# EAGLE design DRV8833 (EAGLE 7.2.0)
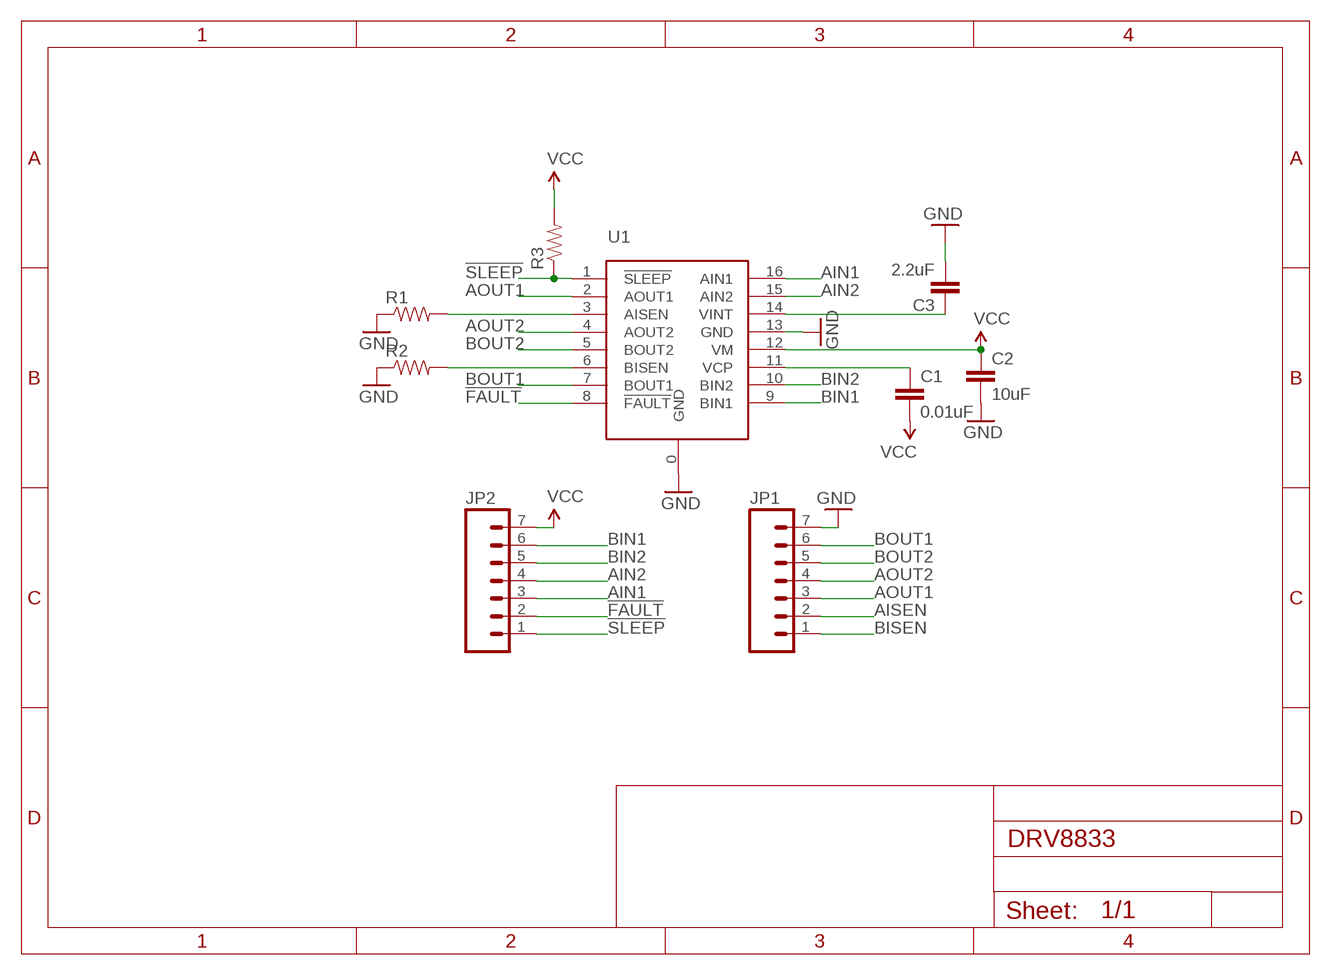
[diagram p0: schematic, sheet 1]

## Parts
C1  0.01uF  CAP0603-CAP  [0603-CAP]
C2  10uF  CAP1206  [1206]
C3  2.2uF  CAP0603-CAP  [0603-CAP]
JP1  M07  [1X07]
JP2  M07  [1X07]
R1  RESISTOR1206  [1206]
R2  RESISTOR1206  [1206]
R3  RESISTOR0603-RES  [0603-RES]
U1  DRV8833  [PWP16]

## Nets
!FAULT: JP2.2 U1.8(!FAULT)
!SLEEP: JP2.1 R3.1 U1.1(!SLEEP)
AIN1: JP2.3 U1.16(AIN1)
AIN2: JP2.4 U1.15(AIN2)
AISEN: JP1.2 R1.2 U1.3(AISEN)
AOUT1: JP1.3 U1.2(AOUT1)
AOUT2: JP1.4 U1.4(AOUT2)
BIN1: JP2.6 U1.9(BIN1)
BIN2: JP2.5 U1.10(BIN2)
BISEN: JP1.1 R2.2 U1.6(BISEN)
BOUT1: JP1.6 U1.7(BOUT1)
BOUT2: JP1.5 U1.5(BOUT2)
GND: C2.2 C3.2 JP1.7 R1.1 R2.1 U1.0(GND) U1.13(GND)
N$14: C1.1 U1.11(VCP)
N$63: C3.1 U1.14(VINT)
VCC: C1.2 C2.1 JP2.7 R3.2 U1.12(VM)

## Library data of the parts
C1-C3 = SparkFun-Passives:CAP: Capacitor Standard 0603 ceramic capacitor, and 0.1" leaded capacitor.
JP1 JP2 = SparkFun-Connectors:M07: Header 7 Standard 7-pin 0.1" header. Use with straight break away headers (SKU : PRT-00116), right angle break away headers (PRT-00553), swiss pins (PRT-00743), machine pins (PRT-00117), and female headers (PRT-00115). NOTES ON THE VARIANTS LOCK and LOCK_LONGPADS... This footprint was designed to help hold the alignment of a through-hole component (i.e. 7-pin header) while soldering it into place. You may notice that each hole has been shifted either up or down by 0.005 of an inch from it's more standard position (which is usually a perfectly straight line). This slight alteration caused the pins (the squares in the middle) to touch the edges of the holes. Because they are alternating, it causes a "brace" to hold the header in place. 0.005 has proven to be the perfect amount of "off-center" position when using our standard breakaway headers. Although looks a little odd when you look at the bare footprint, once you have a header in there, the alteration is very hard to notice. Also, if you push a header all the way into place, it is covered up entirely on the bottom side. This idea of altering the position of holes to aid alignment will be further integrated into the Sparkfun Library for other footprints. It can help hold any component with 3 or more connection pins.
R1-R3 = SparkFun-Passives:RESISTOR: Resistor Basic schematic elements and footprints for 0603, 1206, and PTH resistors.
U1 = DRV8833:DRV8833

## Board
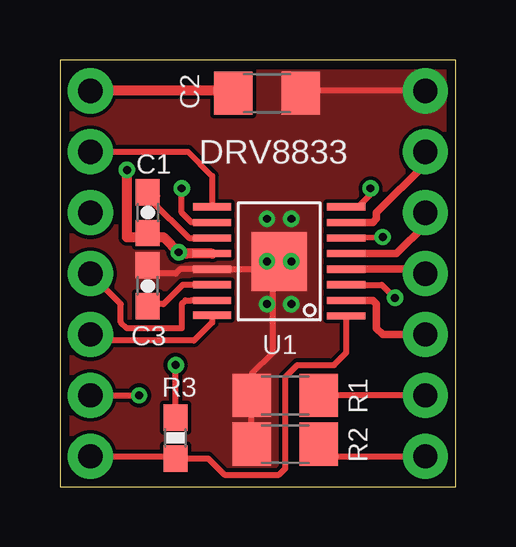
[diagram p1: board, top side]
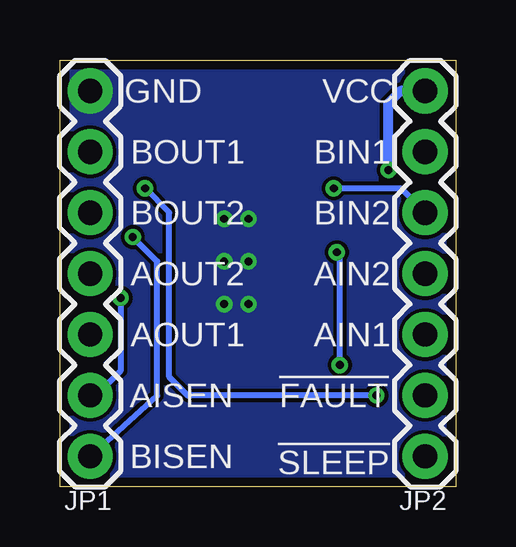
[diagram p2: board, bottom side, seen from below]

Size 16.5 x 17.8 mm. Coordinates in mm from the lower left corner, seen from the top.
Outline: 0,0 16.5,0 16.5,17.8 0,17.8 0,0
Copper layers (1*16): Top 0.0356mm / dielectric 1.5011mm / Bottom 0.0356mm
Design rules "LaenPCBOrder": minimum track width 6mil, minimum drill 13mil, track to track 6mil, track to pad 6mil, pad to pad 6mil, via to via 6mil, smd to smd 6mil, copper to edge 15mil, drill to drill 6mil, minimum pad ring 7mil, minimum via ring 7mil, stop-mask expansion 4mil, vias tented up to drill 13mil, thermal gap 10mil

### Footprints (pad centres in the part's own frame; a part is rotated, then mirrored left to right if it is on the bottom)
0603-CAP = smd 1.1 x 1: 1 -0.85,0; 2 0.85,0
1206 = smd 1.6 x 1.8: 1 -1.4,0; 2 1.4,0
1X07 = drill 1.016 pad 1.88: 1 0,0; 2 2.54,0; 3 5.08,0; 4 7.62,0; 5 10.16,0; 6 12.7,0; 7 15.24,0
0603-RES = smd 1.1 x 1: 1 -0.85,0; 2 0.85,0
PWP16 = smd 2.46 x 2.31: 0 0,0 | smd 0.3 x 1.6: 1 -2.275,-2.8; 2 -1.625,-2.8; 3 -0.975,-2.8; 4 -0.325,-2.8; 5 0.325,-2.8; 6 0.975,-2.8; 7 1.625,-2.8; 8 2.275,-2.8; 9 2.275,2.8; 10 1.625,2.8; 11 0.975,2.8; 12 0.325,2.8; 13 -0.325,2.8; 14 -0.975,2.8; 15 -1.625,2.8; 16 -2.245,2.8

### Placement (x,y rotation side)
C1  3.66,11.43 270 top
C2  8.64,16.42 0 top
C3  3.66,8.38 90 top
JP1  15.24,1.27 90 bottom
JP2  1.27,1.27 90 bottom
R1  9.4,3.81 0 top
R2  9.4,1.78 0 top
R3  4.83,2.03 90 top
U1  9.14,9.4 90 top

### Tracks (layer width: path | path; a pad name or v marks a point on that pad's centre or on a via)
!FAULT  (via drill 0.33)
  Top 0.254: JP2.2 v3.3,3.81 | U1.8 11.7,11.68 12.45,11.68 12.95,12.19 v12.95,12.45
  Bottom 0.254: v3.3,3.81 11.18,3.81 11.94,4.57 11.94,11.43 v12.95,12.45
!SLEEP
  Top 0.254: JP2.1 4.48,1.27 R3.1 6.18,1.18 6.86,0.51 9.14,0.51 9.4,0.76 9.4,4.57 9.91,5.08 11.43,5.08 11.94,5.59 U1.1 11.7,7.12
AIN1
  Top 0.254: U1.16 6.34,6.85 5.59,6.1 1.52,6.1 JP2.3
AIN2
  Top 0.254: U1.15 5.84,7.77 5.49,7.77 5.23,7.77 5.08,7.62 5.08,6.6 2.79,6.6 2.54,6.86 2.54,7.62 JP2.4
AISEN  (via drill 0.33)
  Top 0.254: JP1.2 R1.2 | U1.3 13.42,8.42 v13.97,7.87
  Bottom 0.254: JP1.2 14.99,3.81 13.97,4.83 v13.97,7.87
AOUT1
  Top 0.305: U1.2 13.05,7.77 13.21,7.62 13.21,6.6 13.46,6.35 JP1.3
AOUT2
  Top 0.305: U1.4 15.06,9.07 JP1.4
BIN1
  Top 0.254: JP2.6 5.33,13.97 6.34,12.96 U1.9
BIN2  (via drill 0.33)
  Top 0.254: U1.10 5.49,11.02 5.08,11.43 v5.08,12.45
  Bottom 0.254: v5.08,12.45 2.29,12.45 JP2.5
BISEN  (via drill 0.33)
  Top 0.254: R2.2 11.31,1.27 JP1.1 | U1.6 v13.46,10.41
  Top 0.305: 13.42,10.37 arc90 v13.46,10.41
  Bottom 0.254: JP1.1 12.45,3.81 12.45,9.4 v13.46,10.41
BOUT1
  Top 0.305: U1.7 13.05,11.02 13.21,11.18 13.21,11.43 15.24,13.46 JP1.6
BOUT2
  Top 0.305: U1.5 14.04,9.72 15.24,10.92 JP1.5
GND  (via drill 0.33)
  Top 0.254: R2.1 R1.1 8,4.7 8.89,5.59 8.89,8.89 U1.0 9.07,9.07 U1.13 5.01,9.07 4.83,8.89 4.01,8.89 C3.2 | JP1.7 9.94,16.51 C2.2
  other vias: 8.64,9.4 9.65,9.4 8.64,11.18 9.65,11.18 8.64,7.62 9.65,7.62
  pour Top (no thermals): 0,0 0,17.78 16.26,17.78 16.26,0.25 16.26,0
  pour Bottom (no thermals): 0,0 0,17.78 16.26,17.78 16.26,0
N$14
  Top 0.254: 4.06,12.13 C1.1 arc-3 3.81,11.94 5.38,10.37 U1.11
N$63
  Top 0.254: U1.14 5.12,8.42 4.32,7.62 3.75,7.62 C3.1
VCC  (via drill 0.33)
  Top 0.254: 5.26,9.72 5.08,9.65 v4.95,9.78 | R3.2 v4.83,5.08 | 3.75,10.41 C1.2 | C2.1 7.14,16.51
  Top 0.406: U1.12 5.26,9.72 | v2.79,13.21 2.79,10.41 3.75,10.41 4.32,10.41 v4.95,9.78 | 7.14,16.51 JP2.7
  Bottom 0.254: v4.83,5.08 4.83,9.91 v4.95,9.78
  Bottom 0.406: JP2.7 2.29,16.51 2.79,16 v2.79,13.21

### Text on the board
tPlace: DRV8833
bPlace: VCC | GND | BIN1 | BOUT1 | BIN2 | BOUT2 | AIN2 | AOUT2 | AIN1 | AOUT1 | !FAULT | AISEN | !SLEEP | BISEN